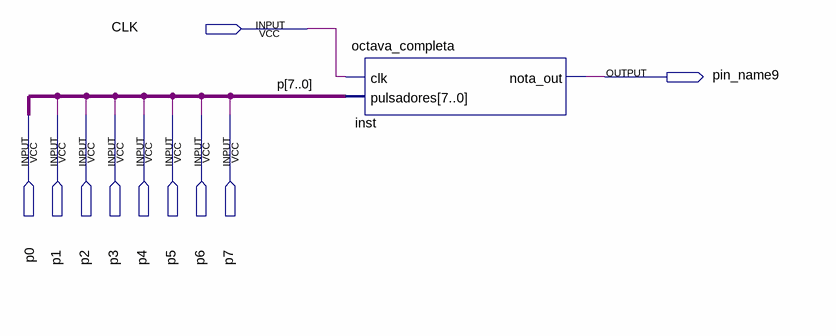
[diagram p0: schematic sheet]
// Quartus schematic PIANO.bdf as structural Verilog: 1 symbols, 10 pins
module PIANO (
  input  CLK,
  input  p0,
  input  p1,
  input  p2,
  input  p3,
  input  p4,
  input  p5,
  input  p6,
  input  p7,
  output pin_name9
);

  octava_completa inst (.clk(CLK), .pulsadores({p7, p6, p5, p4, p3, p2, p1, p0}), .nota_out(pin_name9));
endmodule
